# Altium schematic sheet Fan Controller Overview.SchDoc
size A4; DrawnBy: Craig Comberbach; DocumentNumber: 1; Revision: A1; SheetNumber: 1; SheetTotal: 7
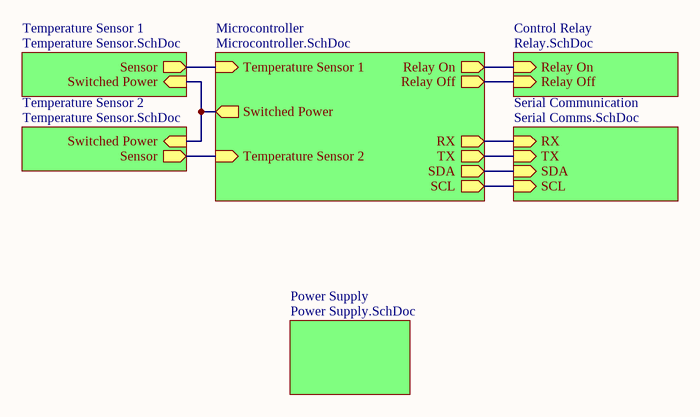
[diagram p0: Fan Controller Overview.SchDoc]

## Sub-sheets
Control Relay = Relay.SchDoc: Relay On (in), Relay Off (in)
Microcontroller = Microcontroller.SchDoc: Temperature Sensor 1 (in), Temperature Sensor 2 (in), Relay On (out), Relay Off (out), Switched Power (out), RX (out), TX (out), SDA (out), SCL (out)
Power Supply = Power Supply.SchDoc: no entries
Serial Communication = Serial Comms.SchDoc: RX (in), TX (in), SDA (in), SCL (in)
Temperature Sensor 1 = Temperature Sensor.SchDoc: Sensor (out), Switched Power (in)
Temperature Sensor 2 = Temperature Sensor.SchDoc: Sensor (out), Switched Power (in)

## Nets
(unnamed): sheet Microcontroller/Temperature Sensor 1, sheet Temperature Sensor 1/Sensor
(unnamed): sheet Microcontroller/Temperature Sensor 2, sheet Temperature Sensor 2/Sensor
(unnamed): sheet Microcontroller/Relay On, sheet Control Relay/Relay On
(unnamed): sheet Microcontroller/Relay Off, sheet Control Relay/Relay Off
(unnamed): sheet Microcontroller/Switched Power, sheet Temperature Sensor 1/Switched Power, sheet Temperature Sensor 2/Switched Power
(unnamed): sheet Microcontroller/RX, sheet Serial Communication/RX
(unnamed): sheet Microcontroller/TX, sheet Serial Communication/TX
(unnamed): sheet Microcontroller/SDA, sheet Serial Communication/SDA
(unnamed): sheet Microcontroller/SCL, sheet Serial Communication/SCL